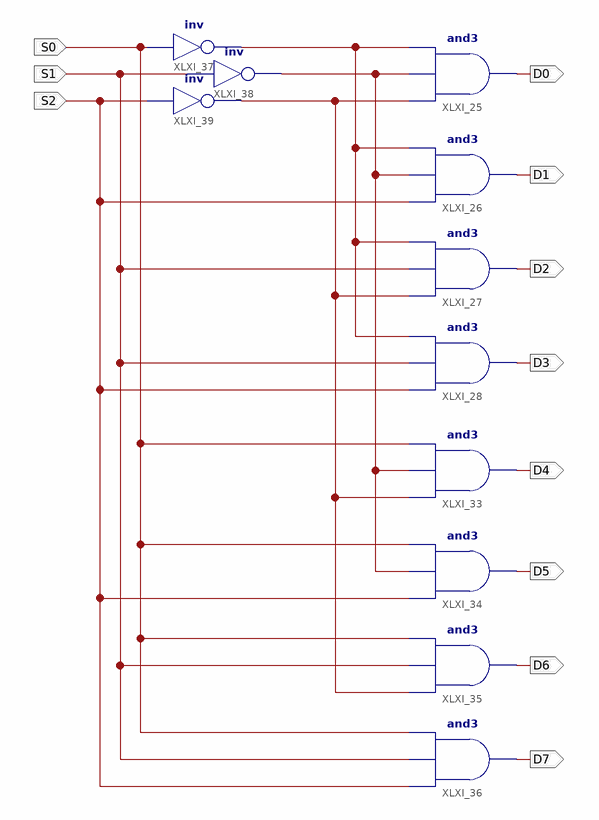
[diagram p0: schematic sheet 1]
// Xilinx ISE schematic Decorder_3_8.sch (spartan3e) as structural Verilog: 11 symbols, 11 ports
module Decorder_3_8 (
  input  S0,
  input  S2,
  input  S1,
  output D0,
  output D1,
  output D2,
  output D3,
  output D4,
  output D5,
  output D6,
  output D7
);

  wire XLXN_16, XLXN_23, XLXN_31;

  and XLXI_25 (D0, XLXN_31, XLXN_23, XLXN_16);
  and XLXI_26 (D1, S2, XLXN_23, XLXN_16);
  and XLXI_27 (D2, XLXN_31, S1, XLXN_16);
  and XLXI_28 (D3, S2, S1, XLXN_16);
  and XLXI_33 (D4, XLXN_31, XLXN_23, S0);
  and XLXI_34 (D5, S2, XLXN_23, S0);
  and XLXI_35 (D6, XLXN_31, S1, S0);
  and XLXI_36 (D7, S2, S1, S0);
  not XLXI_37 (XLXN_16, S0);
  not XLXI_38 (XLXN_23, S1);
  not XLXI_39 (XLXN_31, S2);
endmodule
